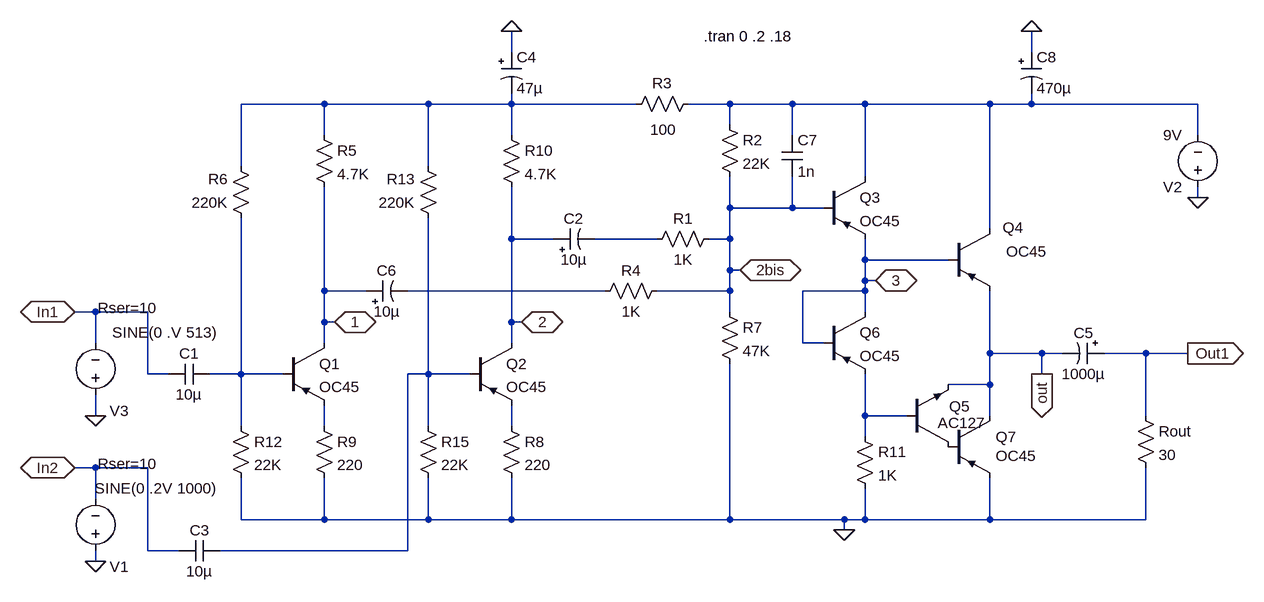
[diagram p0: schematic headamp2.2.asc]
headamp2.2.asc, the LTspice schematic file:
Version 4
SHEET 1 1268 680
WIRE -400 -992 -400 -1024
WIRE 400 -992 400 -1024
WIRE -688 -912 -816 -912
WIRE -528 -912 -688 -912
WIRE -400 -912 -400 -928
WIRE -400 -912 -528 -912
WIRE -208 -912 -400 -912
WIRE -64 -912 -128 -912
WIRE 32 -912 -64 -912
WIRE 144 -912 32 -912
WIRE 336 -912 144 -912
WIRE 400 -912 400 -928
WIRE 400 -912 336 -912
WIRE 656 -912 400 -912
WIRE -64 -880 -64 -912
WIRE -688 -864 -688 -912
WIRE -400 -864 -400 -912
WIRE 32 -864 32 -912
WIRE 656 -864 656 -912
WIRE -816 -816 -816 -912
WIRE -528 -816 -528 -912
WIRE 144 -800 144 -912
WIRE 656 -768 656 -784
WIRE -64 -752 -64 -800
WIRE 32 -752 32 -800
WIRE 32 -752 -64 -752
WIRE 80 -752 32 -752
WIRE 336 -720 336 -912
WIRE -400 -704 -400 -784
WIRE -336 -704 -400 -704
WIRE -176 -704 -272 -704
WIRE -64 -704 -64 -752
WIRE -64 -704 -96 -704
WIRE 144 -672 144 -704
WIRE 272 -672 144 -672
WIRE -64 -656 -64 -704
WIRE -48 -656 -64 -656
WIRE 144 -640 144 -672
WIRE 160 -640 144 -640
WIRE -688 -624 -688 -784
WIRE -624 -624 -688 -624
WIRE -256 -624 -560 -624
WIRE -64 -624 -64 -656
WIRE -64 -624 -176 -624
WIRE 144 -624 144 -640
WIRE 144 -624 48 -624
WIRE -1040 -592 -1072 -592
WIRE -960 -592 -1040 -592
WIRE -64 -592 -64 -624
WIRE 144 -592 144 -624
WIRE -688 -576 -688 -624
WIRE -672 -576 -688 -576
WIRE -400 -576 -400 -704
WIRE -384 -576 -400 -576
WIRE -1040 -544 -1040 -592
WIRE -688 -544 -688 -576
WIRE -400 -544 -400 -576
WIRE 48 -544 48 -624
WIRE 80 -544 48 -544
WIRE 336 -528 336 -624
WIRE 416 -528 336 -528
WIRE 448 -528 416 -528
WIRE 576 -528 512 -528
WIRE 640 -528 576 -528
WIRE -960 -496 -960 -592
WIRE -928 -496 -960 -496
WIRE -816 -496 -816 -736
WIRE -816 -496 -864 -496
WIRE -752 -496 -816 -496
WIRE -528 -496 -528 -736
WIRE -528 -496 -560 -496
WIRE -464 -496 -528 -496
WIRE 416 -496 416 -528
WIRE 336 -480 336 -528
WIRE 336 -480 272 -480
WIRE -1040 -432 -1040 -464
WIRE 144 -432 144 -496
WIRE 208 -432 144 -432
WIRE 336 -432 336 -480
WIRE 576 -432 576 -528
WIRE -816 -416 -816 -496
WIRE -688 -416 -688 -448
WIRE -528 -416 -528 -496
WIRE -400 -416 -400 -448
WIRE 144 -400 144 -432
WIRE -1040 -352 -1072 -352
WIRE -960 -352 -1040 -352
WIRE -1040 -304 -1040 -352
WIRE -816 -272 -816 -336
WIRE -688 -272 -688 -336
WIRE -688 -272 -816 -272
WIRE -528 -272 -528 -336
WIRE -528 -272 -688 -272
WIRE -400 -272 -400 -336
WIRE -400 -272 -528 -272
WIRE -64 -272 -64 -512
WIRE -64 -272 -400 -272
WIRE 112 -272 -64 -272
WIRE 144 -272 144 -320
WIRE 144 -272 112 -272
WIRE 336 -272 336 -336
WIRE 336 -272 144 -272
WIRE 576 -272 576 -352
WIRE 576 -272 336 -272
WIRE 112 -256 112 -272
WIRE -960 -224 -960 -352
WIRE -912 -224 -960 -224
WIRE -560 -224 -560 -496
WIRE -560 -224 -848 -224
WIRE -1040 -208 -1040 -224
FLAG 656 -768 0
FLAG 112 -256 0
FLAG 640 -528 Out1
IOPIN 640 -528 Out
FLAG -1040 -432 0
FLAG 416 -496 out
IOPIN 416 -496 Out
FLAG -400 -1024 0
FLAG -384 -576 2
IOPIN -384 -576 BiDir
FLAG 160 -640 3
IOPIN 160 -640 BiDir
FLAG -1072 -592 In1
IOPIN -1072 -592 BiDir
FLAG -1040 -208 0
FLAG -1072 -352 In2
IOPIN -1072 -352 BiDir
FLAG -672 -576 1
IOPIN -672 -576 BiDir
FLAG -48 -656 2bis
IOPIN -48 -656 BiDir
FLAG 400 -1024 0
SYMBOL voltage 656 -768 R180
WINDOW 123 0 0 Left 2
WINDOW 39 24 -12 Left 2
SYMATTR InstName V2
SYMATTR Value 9V
SYMBOL pnp 272 -720 R0
WINDOW 0 84 -2 Left 2
WINDOW 3 89 35 Left 2
SYMATTR InstName Q4
SYMATTR Value OC45
SYMBOL polcap 512 -544 R90
WINDOW 0 0 32 VBottom 2
WINDOW 3 32 32 VTop 2
SYMATTR InstName C5
SYMATTR Value 1000µ
SYMATTR Description Capacitor
SYMATTR Type cap
SYMATTR SpiceLine V=25 Irms=470m Rser=0.16 Lser=0
SYMBOL res 128 -416 R0
SYMATTR InstName R11
SYMATTR Value 1K
SYMBOL voltage -1040 -448 R180
WINDOW 39 -96 150 Left 2
WINDOW 3 -188 112 Left 2
WINDOW 0 -51 -9 Left 2
SYMATTR SpiceLine Rser=10
SYMATTR Value SINE(0 .V 513)
SYMATTR InstName V3
SYMATTR Value2 AC 1
SYMBOL res 560 -448 R0
SYMATTR InstName Rout
SYMATTR Value 30
SYMBOL pnp 80 -800 R0
SYMATTR InstName Q3
SYMATTR Value OC45
SYMBOL res -80 -896 R0
SYMATTR InstName R2
SYMATTR Value 22K
SYMBOL res -112 -928 R90
WINDOW 0 0 56 VBottom 2
WINDOW 3 40 54 VTop 2
SYMATTR InstName R3
SYMATTR Value 100
SYMBOL res -80 -608 R0
SYMATTR InstName R7
SYMATTR Value 47K
SYMBOL pnp -464 -544 R0
SYMATTR InstName Q2
SYMATTR Value OC45
SYMBOL res -416 -880 R0
SYMATTR InstName R10
SYMATTR Value 4.7K
SYMBOL res -512 -720 R180
WINDOW 0 36 76 Left 2
WINDOW 3 36 40 Left 2
SYMATTR InstName R13
SYMATTR Value 220K
SYMBOL npn 208 -384 M180
WINDOW 0 65 62 Left 2
WINDOW 3 48 37 Left 2
SYMATTR InstName Q5
SYMATTR Value AC127
SYMBOL pnp 272 -432 R0
WINDOW 0 73 33 Left 2
WINDOW 3 73 62 Left 2
SYMATTR InstName Q7
SYMATTR Value OC45
SYMBOL polcap -416 -992 R0
SYMATTR InstName C4
SYMATTR Value 47µ
SYMATTR Description Capacitor
SYMATTR Type cap
SYMATTR SpiceLine V=16 Irms=85m Rser=1.8 Lser=0
SYMBOL polcap -336 -688 R270
WINDOW 0 32 32 VTop 2
WINDOW 3 0 32 VBottom 2
SYMATTR InstName C2
SYMATTR Value 10µ
SYMATTR Description Capacitor
SYMATTR Type cap
SYMATTR SpiceLine V=16 Irms=85m Rser=1.8 Lser=0
SYMBOL pnp 80 -592 R0
SYMATTR InstName Q6
SYMATTR Value OC45
SYMBOL res -416 -432 R0
SYMATTR InstName R8
SYMATTR Value 220
SYMBOL res -544 -432 R0
SYMATTR InstName R15
SYMATTR Value 22K
SYMBOL cap -864 -512 R90
WINDOW 0 0 32 VBottom 2
WINDOW 3 32 32 VTop 2
SYMATTR InstName C1
SYMATTR Value 10µ
SYMBOL cap -848 -240 R90
WINDOW 0 0 32 VBottom 2
WINDOW 3 32 32 VTop 2
SYMATTR InstName C3
SYMATTR Value 10µ
SYMBOL voltage -1040 -208 R180
WINDOW 39 -96 150 Left 2
WINDOW 3 -188 112 Left 2
WINDOW 0 -51 -9 Left 2
SYMATTR SpiceLine Rser=10
SYMATTR Value SINE(0 .2V 1000)
SYMATTR InstName V1
SYMATTR Value2 AC 1
SYMBOL res -80 -720 R90
WINDOW 0 0 56 VBottom 2
WINDOW 3 32 56 VTop 2
SYMATTR InstName R1
SYMATTR Value 1K
SYMBOL res -160 -640 R90
WINDOW 0 0 56 VBottom 2
WINDOW 3 32 56 VTop 2
SYMATTR InstName R4
SYMATTR Value 1K
SYMBOL polcap -624 -608 R270
WINDOW 0 32 32 VTop 2
WINDOW 3 0 32 VBottom 2
SYMATTR InstName C6
SYMATTR Value 10µ
SYMATTR Description Capacitor
SYMATTR Type cap
SYMATTR SpiceLine V=16 Irms=85m Rser=1.8 Lser=0
SYMBOL pnp -752 -544 R0
SYMATTR InstName Q1
SYMATTR Value OC45
SYMBOL res -704 -880 R0
SYMATTR InstName R5
SYMATTR Value 4.7K
SYMBOL res -800 -720 R180
WINDOW 0 36 76 Left 2
WINDOW 3 36 40 Left 2
SYMATTR InstName R6
SYMATTR Value 220K
SYMBOL res -704 -432 R0
SYMATTR InstName R9
SYMATTR Value 220
SYMBOL res -832 -432 R0
SYMATTR InstName R12
SYMATTR Value 22K
SYMBOL cap 16 -864 R0
SYMATTR InstName C7
SYMATTR Value 1n
SYMBOL polcap 384 -992 R0
SYMATTR InstName C8
SYMATTR Value 470µ
SYMATTR Description Capacitor
SYMATTR Type cap
SYMATTR SpiceLine V=16 Irms=85m Rser=1.8 Lser=0
TEXT -104 -1016 Left 2 !.tran 0 .2 .18

The netlist it stands for:
* headamp2.2.asc
V2 0 N002 9V
Q4 N002 3 out 0 OC45
C5 Out1 out 1000µ V=25 Irms=470m Rser=0.16 Lser=0
R11 N007 0 1K
V3 0 In1 SINE(0 .V 513) AC 1 Rser=10
Rout Out1 0 30
Q3 N002 2bis 3 0 OC45
R2 N002 2bis 22K
R3 N002 N001 100
R7 2bis 0 47K
Q2 2 N006 N009 0 OC45
R10 N001 2 4.7K
R13 N006 N001 220K
Q5 P001 N007 out 0 AC127
Q7 out P001 0 0 OC45
C4 0 N001 47µ V=16 Irms=85m Rser=1.8 Lser=0
C2 2 N003 10µ V=16 Irms=85m Rser=1.8 Lser=0
Q6 3 3 N007 0 OC45
R8 N009 0 220
R15 N006 0 22K
C1 N005 In1 10µ
C3 N006 In2 10µ
V1 0 In2 SINE(0 .2V 1000) AC 1 Rser=10
R1 2bis N003 1K
R4 2bis N004 1K
C6 1 N004 10µ V=16 Irms=85m Rser=1.8 Lser=0
Q1 1 N005 N008 0 OC45
R5 N001 1 4.7K
R6 N005 N001 220K
R9 N008 0 220
R12 N005 0 22K
C7 N002 2bis 1n
C8 0 N002 470µ V=16 Irms=85m Rser=1.8 Lser=0
.model NPN NPN
.model PNP PNP
.lib standard.bjt
.tran 0 .2 .18
.backanno
.end